# Altium schematic sheet [03] - PROJECT SCHEMATIC.SchDoc: = ProjectName
size A3; PageSetup: Record=PageOptions|CenterHorizontal=True|CenterVertical=True|PrintScale=1.07|XCorrection=1.00|YCorrection=1.00|PrintKind=1|BorderSize=5000000|LeftOffset=0|BottomOffset=0|Orientation=2|PaperLength=1000|PaperWidth=1000|Scale=100|PaperSource=7|PrintQuality=600|MediaType=1|DitherType=10|PaperKind=A3|PrintScaleMode=1; Author: ABC; Organization: Altium Limited; Address1: L3, 12a Rodborough Rd; Address2: Frenchs Forest; Address3: NSW; Address4: Australia 2086; DocumentNumber: 1; SheetNumber: 1; SheetTotal: 1; PROJECT CODE: A_V1.0
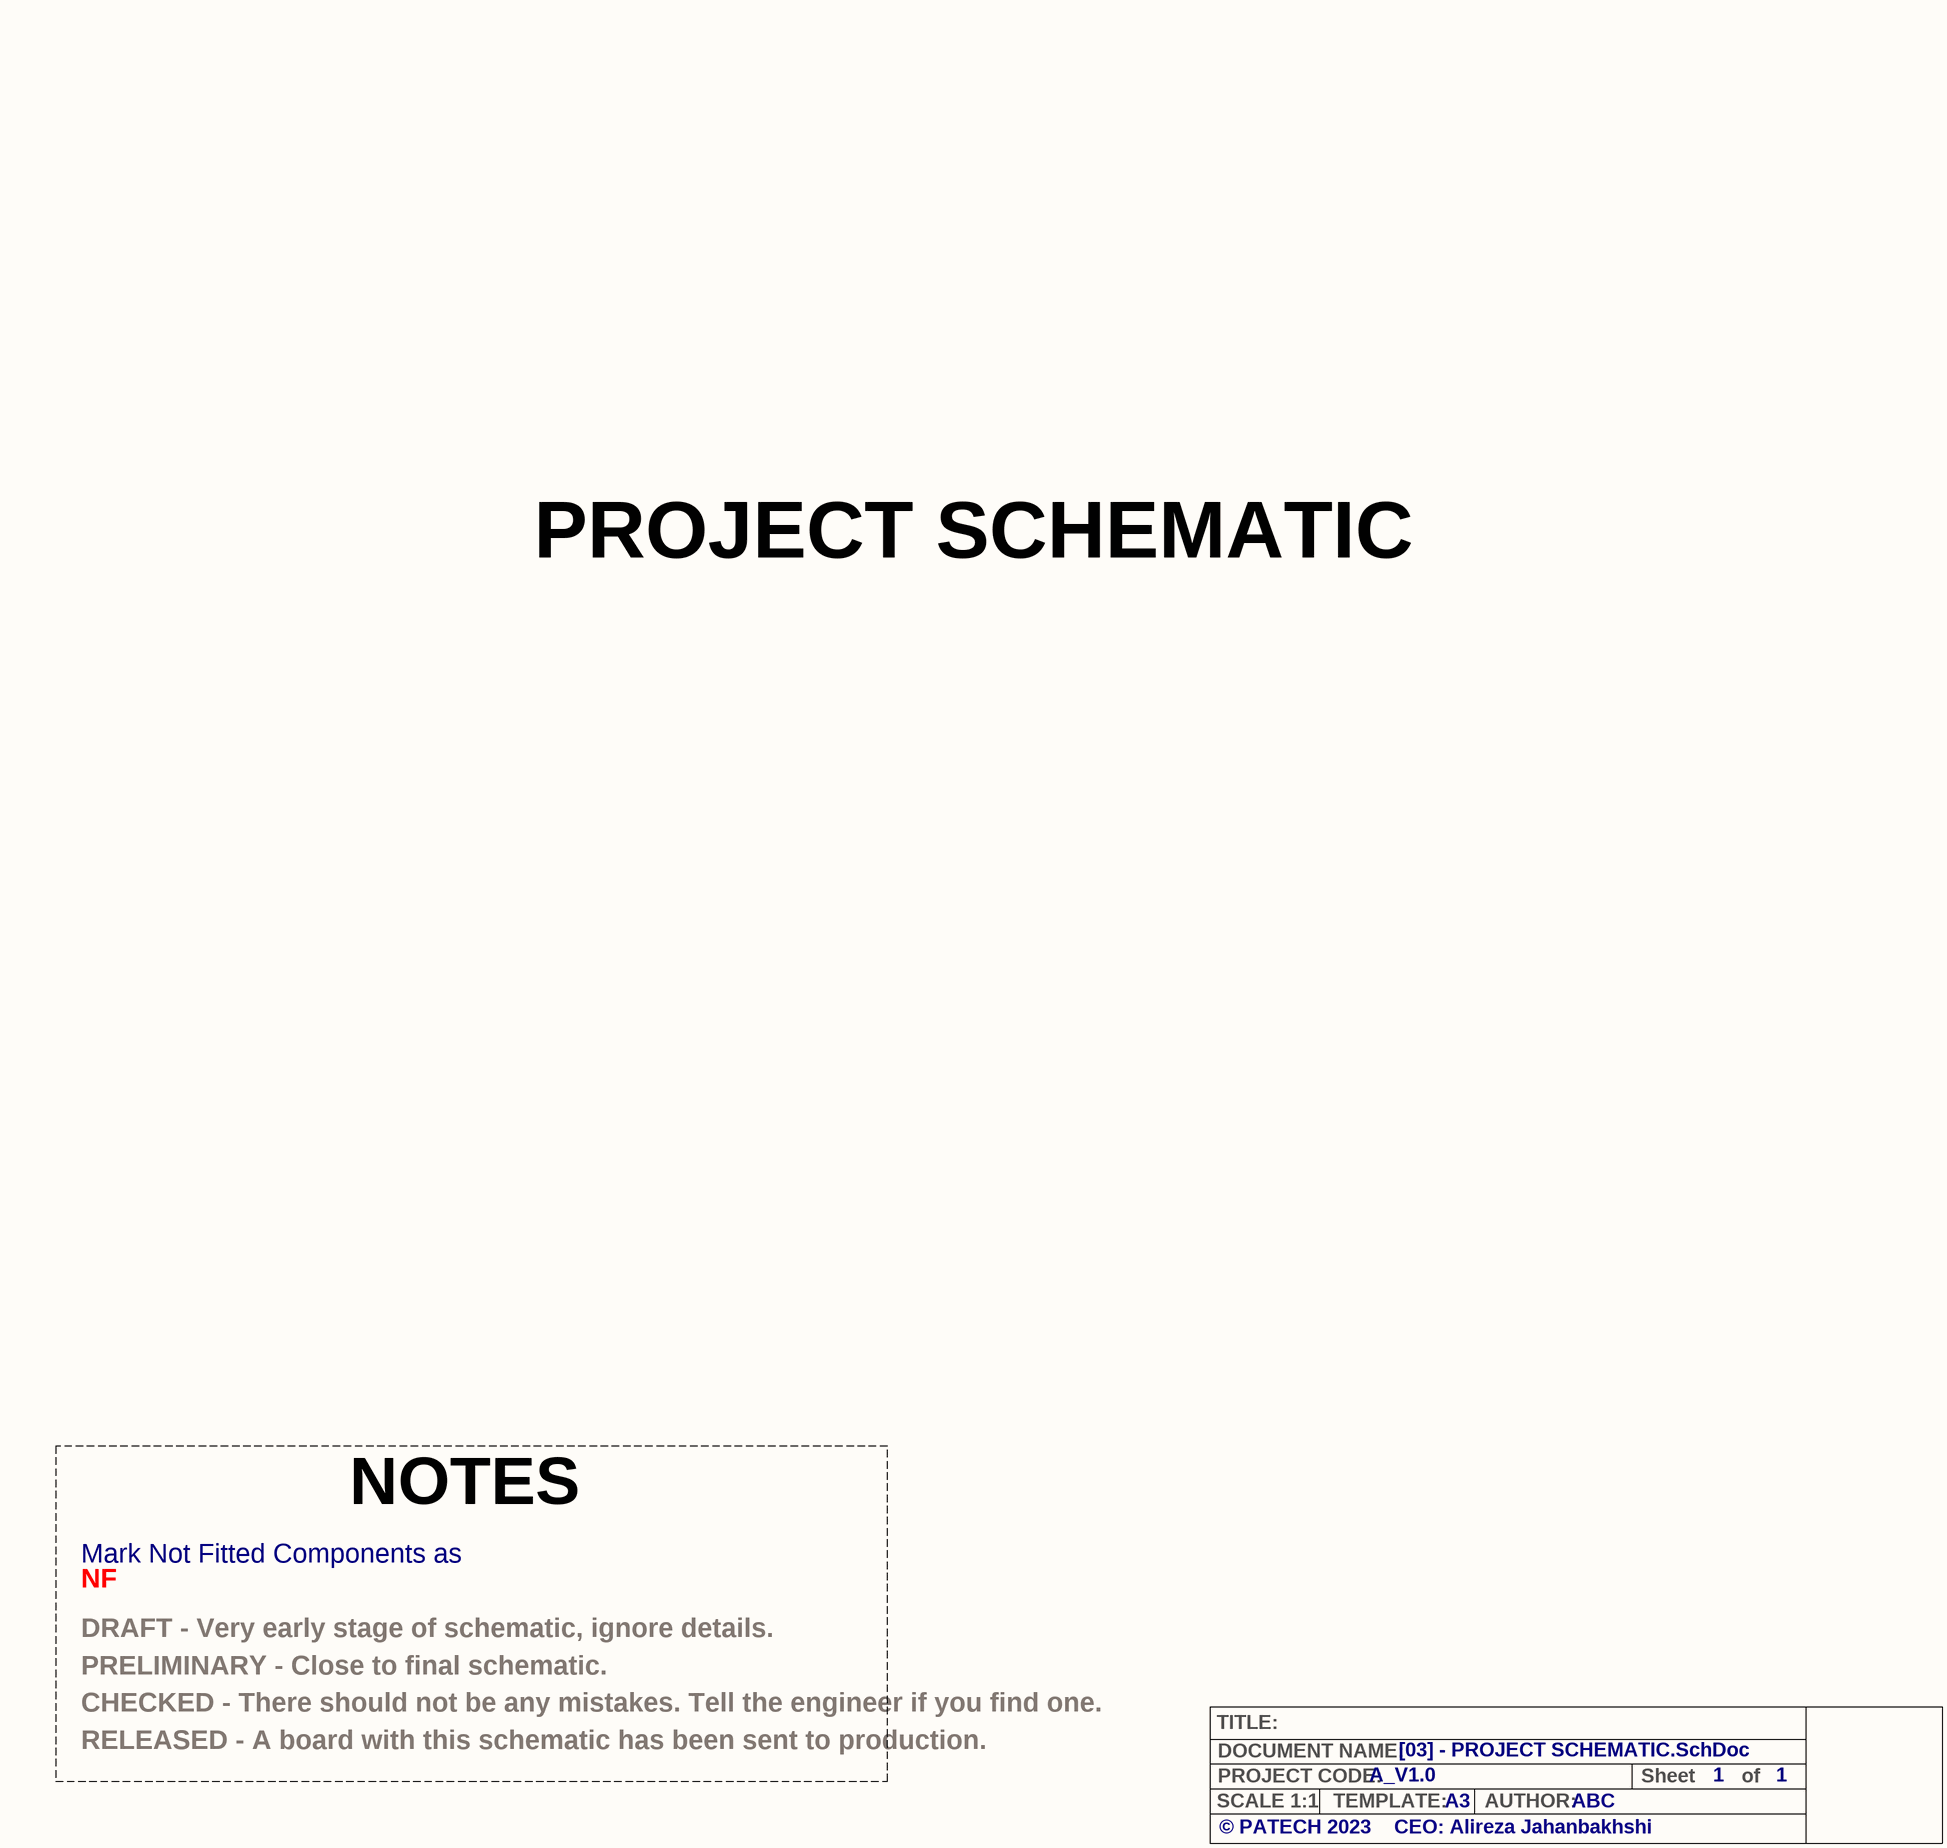
[diagram p0: [03] - PROJECT SCHEMATIC.SchDoc]

## Notes on the sheet
- PROJECT SCHEMATIC
- NOTES
- NF
- Mark Not Fitted Components as
- PRELIMINARY - Close to final schematic.
- DRAFT - Very early stage of schematic, ignore details.
- CHECKED - There should not be any mistakes. Tell the engineer if you find one.
- RELEASED - A board with this schematic has been sent to production.
- TITLE:
- DOCUMENT NAME:
- PROJECT CODE:
- Sheet
- of
- SCALE 1:1
- © PATECH 2023
- TEMPLATE:
- CEO: Alireza Jahanbakhshi
- A3
- AUTHOR: